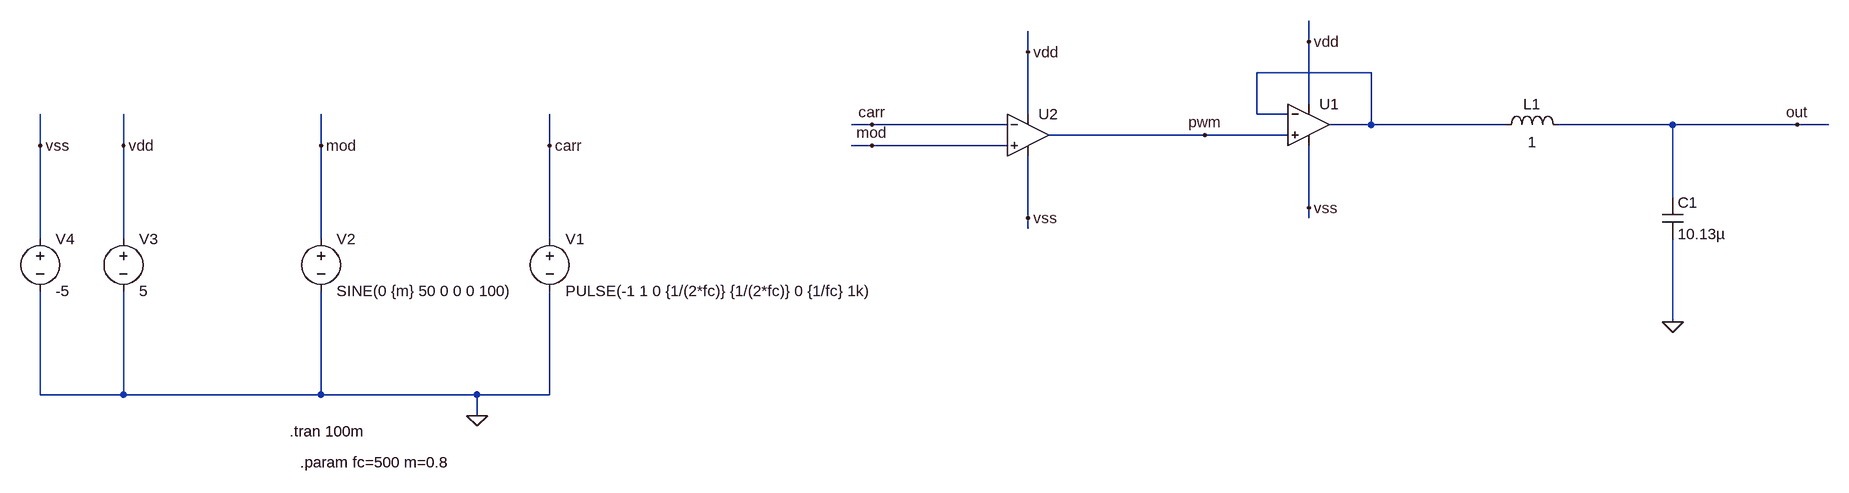
[diagram p0: schematic sin_pwm_v0p0.asc]
sin_pwm_v0p0.asc, the LTspice schematic file:
Version 4
SHEET 1 2084 680
WIRE 1200 -176 1200 -208
WIRE 768 -160 768 -192
WIRE 1296 -128 1120 -128
WIRE 1200 -80 1200 -176
WIRE 768 -64 768 -160
WIRE 1120 -64 1120 -128
WIRE 1168 -64 1120 -64
WIRE 528 -48 496 -48
WIRE 736 -48 528 -48
WIRE 1296 -48 1296 -128
WIRE 1296 -48 1232 -48
WIRE 1504 -48 1296 -48
WIRE 1760 -48 1584 -48
WIRE 1952 -48 1760 -48
WIRE 2000 -48 1952 -48
WIRE 1040 -32 800 -32
WIRE 1168 -32 1040 -32
WIRE -752 -16 -752 -64
WIRE -624 -16 -624 -64
WIRE -320 -16 -320 -64
WIRE 32 -16 32 -64
WIRE 528 -16 496 -16
WIRE 736 -16 528 -16
WIRE 1760 64 1760 -48
WIRE 1200 80 1200 -16
WIRE 768 96 768 0
WIRE 1200 96 1200 80
WIRE 768 112 768 96
WIRE -752 128 -752 -16
WIRE -624 128 -624 -16
WIRE -320 128 -320 -16
WIRE 32 128 32 -16
WIRE 1760 256 1760 128
WIRE -752 368 -752 208
WIRE -624 368 -624 208
WIRE -624 368 -752 368
WIRE -320 368 -320 208
WIRE -320 368 -624 368
WIRE -80 368 -320 368
WIRE 32 368 32 208
WIRE 32 368 -80 368
WIRE -80 400 -80 368
FLAG -80 400 0
FLAG 32 -16 carr
FLAG -320 -16 mod
FLAG 768 -160 vdd
FLAG -624 -16 vdd
FLAG 528 -48 carr
FLAG 528 -16 mod
FLAG 1040 -32 pwm
FLAG -752 -16 vss
FLAG 768 96 vss
FLAG 1760 256 0
FLAG 1952 -48 out
FLAG 1200 -176 vdd
FLAG 1200 80 vss
SYMBOL voltage 32 112 R0
WINDOW 123 0 0 Left 0
WINDOW 39 0 0 Left 0
SYMATTR InstName V1
SYMATTR Value PULSE(-1 1 0 {1/(2*fc)} {1/(2*fc)} 0 {1/fc} 1k)
SYMBOL voltage -320 112 R0
WINDOW 123 0 0 Left 0
WINDOW 39 0 0 Left 0
SYMATTR InstName V2
SYMATTR Value SINE(0 {m} 50 0 0 0 100)
SYMBOL voltage -624 112 R0
WINDOW 123 0 0 Left 0
WINDOW 39 0 0 Left 0
SYMATTR InstName V3
SYMATTR Value 5
SYMBOL voltage -752 112 R0
WINDOW 123 0 0 Left 0
WINDOW 39 0 0 Left 0
SYMATTR InstName V4
SYMATTR Value -5
SYMBOL ind 1488 -32 R270
WINDOW 0 32 56 VTop 2
WINDOW 3 5 56 VBottom 2
SYMATTR InstName L1
SYMATTR Value 1
SYMATTR SpiceLine Rser=1m
SYMBOL cap 1744 64 R0
SYMATTR InstName C1
SYMATTR Value 10.13µ
SYMBOL OpAmps/UniversalOpAmp2 768 -32 R0
SYMATTR InstName U2
SYMBOL OpAmps/UniversalOpAmp2 1200 -48 R0
SYMATTR InstName U1
TEXT -368 424 Left 2 !.tran 100m
TEXT -352 472 Left 2 !.param fc=500 m=0.8

The netlist it stands for:
* sin_pwm_v0p0.asc
V1 carr 0 PULSE(-1 1 0 {1/(2*fc)} {1/(2*fc)} 0 {1/fc} 1k)
V2 mod 0 SINE(0 {m} 50 0 0 0 100)
V3 vdd 0 5
V4 vss 0 -5
L1 N001 out 1 Rser=1m
C1 out 0 10.13µ
XU2 mod carr vdd vss pwm level2 Avol=1Meg GBW=10Meg Slew=10Meg Ilimit=25m Rail=0 Vos=0 En=0 Enk=0 In=0 Ink=0 Rin=500Meg  ; pins In+ In- V+ V- OUT
XU1 pwm N001 vdd vss N001 level2 Avol=1Meg GBW=10Meg Slew=10Meg Ilimit=25m Rail=0 Vos=0 En=0 Enk=0 In=0 Ink=0 Rin=500Meg  ; pins In+ In- V+ V- OUT
.tran 100m
.param fc=500 m=0.8
.lib UniversalOpAmp2.lib
.backanno
.end